# EAGLE design flora_vibe (EAGLE 6.4)
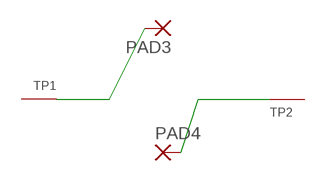
[diagram p0: schematic, sheet 1]

## Parts
PAD3  2,54/1,0  [2,54/1,0]
PAD4  2,54/1,0  [2,54/1,0]
TP1  SEWTAP0.4IN  [SEWINGTAP_0.4]
TP2  SEWTAP0.4IN  [SEWINGTAP_0.4]

## Nets
N$1: PAD3.1(P) TP1.TAP(SEW)
N$2: PAD4.1(P) TP2.TAP(SEW)

## Library data of the parts
PAD3 PAD4 = wirepad:2,54/1,0: THROUGH-HOLE PAD
TP1 TP2 = adafruit:SEWTAP

## Net classes
0 default: clearance 0.355 mm

## Board
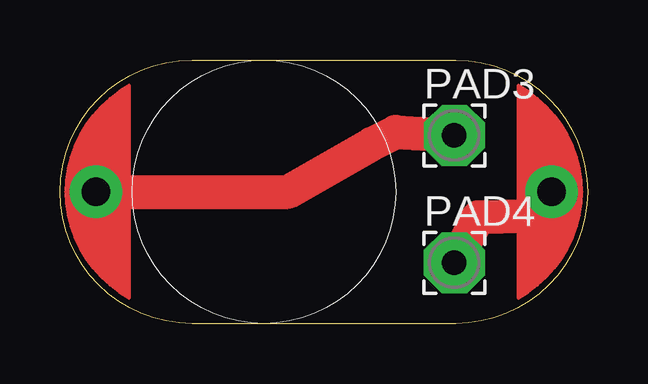
[diagram p1: board, top side]

Size 22 x 11 mm. Coordinates in mm from the lower left corner, seen from the top.
Outline: 5.5,0 arc-180 5.5,11 16.5,11 arc-180 16.5,0 5.5,0
Copper layers (1*16): Top 0.035mm / dielectric 1.5mm / Bottom 0.035mm
Design rules "default": minimum track width 10mil, minimum drill 24mil, track to track 8mil, track to pad 8mil, pad to pad 8mil, via to via 8mil, smd to smd 8mil, copper to edge 40mil, drill to drill 8mil, minimum pad ring 10mil, minimum via ring 8mil, stop-mask expansion 4mil, vias tented up to drill 0mil, thermal gap 10mil

### Footprints (pad centres in the part's own frame; a part is rotated, then mirrored left to right if it is on the bottom)
2,54/1,0 = drill 1.016 pad 2.54 octagon: 1 0,0
SEWINGTAP_0.4 = drill 1.2 pad 2.184: TAP 0,0

### Placement (x,y rotation side)
PAD3  16.45,7.85 0 top
PAD4  16.45,2.54 0 top
TP1  1.5,5.5 90 top
TP2  20.5,5.5 270 top

### Tracks (layer width: path | path; a pad name or v marks a point on that pad's centre or on a via)
N$1
  Top 1.422: TP1.TAP 9.5,5.5 13,7.5 14,8 PAD3.1
N$2
  Top 1.422: PAD4.1 17.45,4.45 19.5,4.5 TP2.TAP